# Altium schematic sheet battery-module-60mm-side.SchDoc
size A4; SheetNumber: 1; SheetTotal: 1
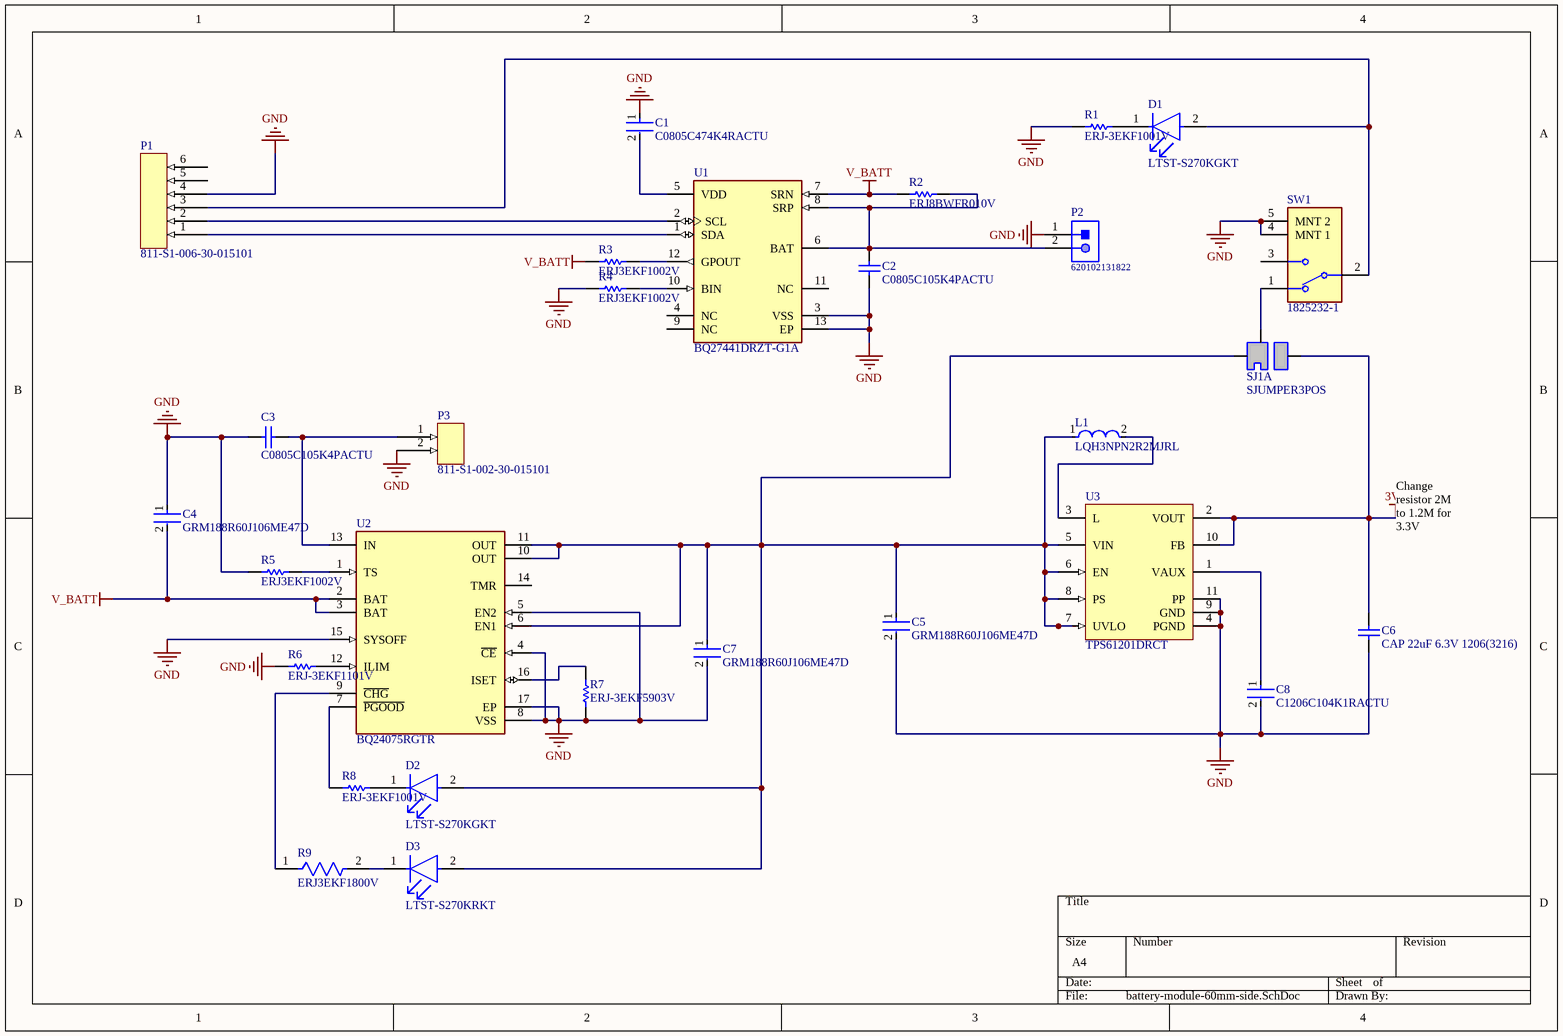
[diagram p0: battery-module-60mm-side.SchDoc]

## Parts
C1  C0805C474K4RACTU  [FP-C0805C-DN-MFG]
C2  C0805C105K4PACTU  [CAPC2013X145X50ML20T25]
C3  C0805C105K4PACTU  [CAPC2013X145X50ML20T25]
C4  GRM188R60J106ME47D  [FP-GRM188-0_1-e0_2_0_55-IPC_A]
C5  GRM188R60J106ME47D  [FP-GRM188-0_1-e0_2_0_55-IPC_A]
C6  CAP 22uF 6.3V 1206(3216)  [CAPC1206(3216)190_L]
C7  GRM188R60J106ME47D  [FP-GRM188-0_1-e0_2_0_55-IPC_A]
C8  C1206C104K1RACTU  [FP-C1206C-EB-MFG]
D1  LTST-S270KGKT  [FP-LTST-S270KGKT-MFG]
D2  LTST-S270KGKT  [FP-LTST-S270KGKT-MFG]
D3  LTST-S270KRKT  [FP-LTST-S270KRKT-MFG]
L1  LQH3NPN2R2MJRL  [FP-LQH3NPN_JR-MFG]
P1  811-S1-006-30-015101  [New footprint 1]
P2  620102131822  [620102131822]
P3  811-S1-002-30-015101  [811-S1-002-30-015101-Footprint-1]
R1  ERJ-3EKF1001V  [RESC1608X55X30ML15T15]
R2  ERJ8BWFR010V  [RESC3216X70X50NL05T20]
R3  ERJ3EKF1002V  [RESC1609X55X30ML15T15]
R4  ERJ3EKF1002V  [RESC1609X55X30ML15T15]
R5  ERJ3EKF1002V  [RESC1609X55X30ML15T15]
R6  ERJ-3EKF1101V  [RESC1608X55X30ML15T15]
R7  ERJ-3EKF5903V  [RESC1608X55X30ML15T15]
R8  ERJ-3EKF1001V  [RESC1608X55X30ML15T15]
R9  ERJ3EKF1800V  [FP-ERJ3EK-MFG]
SJ1  SJUMPER3POS  [SJUMPER3POS-Footprint-1]  (part A of 2)
SW1  1825232-1  [FP-1825232-1-MFG]
U1  BQ27441DRZT-G1A  [FP-DRZ0012A-MFG]
U2  BQ24075RGTR  [FP-RGT0016C-IPC_A]
U3  TPS61201DRCT  [DRC0010J_V]

## Nets
3V3: C6.2 SJ1.3 U3.2(VOUT) U3.10(FB)
GND: C1.1 C2.1 C3.2 C4.1 C5.2 C6.1 C7.2 C8.2 P1.4 P2.1 P3.2 R1.1 R4.1 R5.1 R6.1 R7.1 SW1.4(MNT_1) SW1.5(MNT_2) U1.3(VSS) U1.13(EP) U2.4(~{CE}) U2.5(EN2) U2.8(VSS) U2.15(SYSOFF) U2.17(EP) U3.4(PGND) U3.9(GND) U3.11(PP)
V_BATT: C4.2 R2.1 R3.1 U1.7(SRN) U2.2(BAT) U2.3(BAT)
NetC1_2: C1.2 U1.5(VDD)
NetC2_2: C2.2 P2.2 R2.2 U1.6(BAT) U1.8(SRP)
NetC3_1: C3.1 P3.1 U2.13(IN)
NetC5_1: C5.1 C7.1 D2.2(A) D3.2(A) L1.1 SJ1.1 U2.6(EN1) U2.10(OUT) U2.11(OUT) U3.5(VIN) U3.6(EN) U3.7(UVLO) U3.8(PS)
NetC8_1: C8.1 U3.1(VAUX)
NetD1_1: D1.1(C) R1.2
NetD1_2: D1.2(A) P1.3 SW1.2
NetD2_1: D2.1(C) R8.2
NetD3_1: D3.1(C) R9.2
NetL1_2: L1.2 U3.3(L)
NetP1_1: P1.1 U1.1(SDA)
NetP1_2: P1.2 U1.2(SCL)
NetR3_2: R3.2 U1.12(GPOUT)
NetR4_2: R4.2 U1.10(BIN)
NetR5_2: R5.2 U2.1(TS)
NetR6_2: R6.2 U2.12(ILIM)
NetR7_2: R7.2 U2.16(ISET)
NetR8_1: R8.1 U2.7(~{PGOOD})
NetR9_1: R9.1 U2.9(~{CHG})
NetSJ1_2: SJ1.2 SW1.1

Not connected (* = marked no-connect by the designer): P1 5 6; SW1 3; U1 4(NC) 9(NC) 11(NC); U2 14(TMR)

## Notes on the sheet
- Change resistor 2M to 1.2M for 3.3V

## Library data of the parts
C1 = CMP-2007-03296-2: CAP CER 0.47UF 16V 10% X7R 0805; Manufacturer: KEMET; Value: 0.47 μF; Temperature Coefficient: 30ppm/°C; Tolerance: 0.1; Material: Ceramic; Device Class L3: Ceramic Capacitors; RoHS: TRUE; ComponentLink2Description: Datasheet; Digikey Description: CAP CER 0.47UF 16V 10% X7R 0805; Temperature Characteristic: X7R; Device Class L1: Passive Components; Device Class L2: Capacitors; Octopart: https://octopart.com/c0805c474k4ractu-kemet-107561; Category: Cap; Ipc Land Pattern Name: CAPC200125X78; Package: C0805C-DN; Capacitance: 0.47 μF; ComponentLink2URL: https://content.kemet.com/datasheets/KEM_C1003_C0G_SMD.pdf; Automotive: No; Height: 0.88mm; Temperature: -55°C to +125°C; Manufacturer Part Number: C0805C474K4RACTU; Voltage Rating: 16 V; Temperature Range High: +125°C; Lead Free: Yes; Mouser Description: Multilayer Ceramic Capacitor, C Series, 0.47 - F, - 10%, X7r, 16 V, 0805 [2012 Metric] Rohs Compliant: Yes; Temperature Range Low: -55°C
C2 C3 = CMP-1036-04746-2: Manufacturer: Kemet; Part Number: C0805C105K4PACTU
C4 C5 C7 = CMP-2006-02792-2: Chip Multilayer Ceramic Capacitors for General Purpose, 0603, 10uF, X5R, 15%, 20%, 6.3V; Packaging: Tape and Reel; Voltage Rating (DC): 6.3V; Width: 0.031inch; Termination: SMD/SMT; Dielectric: X5R; Package Quantity: 4000; Voltage Rating: 6.3V; Capacitance: 10uF; Case/Package: 0603; Min Operating Temperature: -55°C; Voltage: 6.3V; Length: 1.6mm; Thickness: 0.035inch; Lead Free: Lead Free; Depth: 0.8mm; Case Code (Imperial): 0603; Max Operating Temperature: 85°C; Material: Ceramic; Height: 0.8mm; Tolerance: 20%; Mount: Surface Mount; REACH SVHC: No SVHC; Radiation Hardening: No; Case Code (Metric): 1608
C6 = CMP-1037-04986-1: CAP 22uF 6.3V ±20% 1206 (3216 Metric) Thickness 1.9mm SMD; Case-EIA: 1206; Tolerance: Â±20%; Case-Metric: 3216; Value: 22uF; Max Thickness: 1.9 mm; Rated Voltage: 6.3 V; Technology: SMT
C8 = CMP-03020-000153-1: CAP CER 0.1UF 100V X7R 1206; Manufacturer: KEMET; Value: 0.10 μF; Tolerance: 0.1; Material: Ceramic; Temperature Coefficient: 15%; Automotive Grade: Grade 0; Voltage Rating: 100 V; Automotive: Yes; Ipc Land Pattern Name: CAPC320160X78; Device Class L1: Passive Components; ComponentLink2Description: Datasheet; Temperature Range Low: -55°C; Category: Cap; Octopart: https://octopart.com/c1206c104k1ractu-kemet-89521; Height: 0.88mm; Lead Free: Yes; Digikey Description: CAP CER 0.1UF 100V X7R 1206; Mouser Description: CAP CER 0.1UF 100V X7R 1206; Device Class L3: Ceramic Capacitors; Device Class L2: Capacitors; ComponentLink2URL: https://content.kemet.com/datasheets/KEM_C1007_X8R_ULTRA_150C_SMD.pdf; Temperature Range High: +150°C; Temperature Characteristic: X7R; Manufacturer Part Number: C1206C104K1RACTU; RoHS: TRUE; Capacitance: 0.10 μF; Package: C1206C-EB; Temperature: -55°C to +150°C
D1 D2 = CMP-2000-06629-2: LED GREEN CLEAR CHIP SMD R/A; Luminous Intensity: 71mcd; Test Current: 20mA; Dominant Wavelength: 571nm; Lens Style: Diffused; Forward Voltage: 2V; Reverse Voltage: 5V; Wavelength: 574nm; Power Rating: 75mW; Viewing Angle: 130°; Number of Elements: 1; Forward Current: 30mA; Lens Color: Colorless; Package Quantity: 1; Lead Free: Lead Free; Case Code (Imperial): 0603; Lens Transparency: Clear; Width: 1.15mm; Case Code (Metric): 1608; Packaging: Tape and Reel; Depth: 0.6mm; Radiation Hardening: No; Color: Green; Max Operating Temperature: 85°C; Case/Package: 0603; Min Operating Temperature: -55°C; Number of LEDs: 1; Power Dissipation: 75mW; Illumination Color: Green; Number of Pins: 2; Height: 0.6mm; Mount: Surface Mount; Length: 1.6mm
D3 = CMP-2000-06630-2: LED RED CLEAR CHIP SMD R/A; Test Current: 20mA; Number of LEDs: 1; Power Rating: 75mW; Lens Style: Diffused; Luminous Intensity: 54mcd; Wavelength: 639nm; Dominant Wavelength: 631nm; Lens Color: Colorless; Forward Voltage: 2V; Viewing Angle: 130°; Forward Current: 30mA; Reverse Voltage: 5V; Illumination Color: Red; Case Code (Imperial): 0603; Color: Red; Packaging: Tape and Reel; Number of Pins: 2; Length: 1.6mm; Lens Transparency: Clear; Width: 1.15mm; Power Dissipation: 75mW; Lead Free: Lead Free; Max Power Dissipation: 75mW; Case/Package: 0603; Max Operating Temperature: 85°C; Mount: Surface Mount; Depth: 0.6mm; Number of Elements: 1; Radiation Hardening: No; Case Code (Metric): 1608; Package Quantity: 1; Height: 0.6mm; Min Operating Temperature: -55°C
L1 = CMP-06042-014664-1: Wire Wound Ferrite Inductor for Power Lines 2.2μH ±20% 0.0816Ω 2200mA 1212; Current Rating: 980mA; Shielding: Shielded; Test Frequency: 1MHz; Saturation Current: 1.8A; Inductance: 2.2uH; Self Resonant Frequency: 45MHz; DC Resistance (DCR): 81.6mR; Case Code (Imperial): 1212; Mount: Surface Mount; Height - Seated (Max): 0.047inch; Min Operating Temperature: -40°C; Tolerance: 20%; Length: 0.118inch; Max Operating Temperature: 105°C; Case Code (Metric): 3030; Resistor Type: Wirewound; Core Material: Ferrite; Width: 0.118inch; Packaging: Tape and Reel; Case/Package: 1212
P1 = CMP-002-00071-2: Conn Spring Piston 6POS SMD
P2 = CMP-1502-00669-1: Male Shrouded Header WR-WTB, SMT, Right Angled, pitch 2 mm, 1 x 2 position; Manufacturer: Wurth Elektronik; Position: 1x2; Working Voltage: 100VAC; Contact Resistance: 20mOhm; Pitch: 2mm; Packaging: TapeandReel; Part Number: 620102131822; Publisher: WurthElektronik; Mounting Technology: SMT; Manufacturer URL: http://www.we-online.de; Datasheet URL: https://katalog.we-online.de/em/datasheet/6201xx131822.pdf; Gender: Male; Operating Temperature: -25to85degC; Package Reference: 620102131822; Orientation: RightAngled
P3 = CMP-002-00073-2: Conn Spring Loaded Connector HDR 2 POS 2.54mm Solder ST SMD T/R
R1 R8 = CMP-2000-00180-1: Manufacturer: Panasonic; Part Number: ERJ-3EKF1001V
R2 = CMP-2003-00764-1: Manufacturer: Panasonic; Part Number: ERJ8BWFR010V
R3-R5 = CMP-1012-00623-3: Chip Resistor, 10 KOhm, +/- 1%, 0.1 W, -55 to 155 degC, 0603 (1608 Metric), RoHS, Tape and Reel; Manufacturer: Panasonic; Voltage Rating: 75V; Case\/Package: 0603; Power Rating: 100mW; Resistance: 10KOhm; Temperature Coefficient: 100ppm\/degreesC; Number of Pins: 2; Package Reference: 603; Depth: 0.8mm; Mount: SurfaceMount; Package Description: 2-Pin Surface Mount Device, Body 1.6 x 0.85 mm; Datasheet Version: 02/2017; Length: 1.6mm; Lead Free: LeadFree; Height: 0.45mm; Number of Terminations: 2; Max Power Dissipation: 100mW; Min Operating Temperature: -55degC; Datasheet URL: https://industrial.panasonic.com/cdbs/www-data/pdf/RDA0000/AOA0000C304.pdf; Termination: SMD/SMT; Case Code (Metric): 1608; Case Code (Imperial): 0603; Tolerance: 1%; Max Operating Temperature: 155degC; RoHSCompliant: true; Voltage Rating (DC): 75V; Radiation Hardening: No; Packaging: TapeandReel; Composition: ThickFilm; Mounting Technology: SurfaceMount; Manufacturer URL: http://www.panasonic.com/; Width: 0.031inch; REACH SVHC: NoSVHC; Contact Plating: Tin; Military Standard: Not; Package Quantity: 1
R6 = CMP-2000-00198-1: Manufacturer: Panasonic; Part Number: ERJ-3EKF1101V
R7 = CMP-2000-00582-1: Manufacturer: Panasonic; Part Number: ERJ-3EKF5903V
R9 = CMP-2000-00293-2: RES SMD 180 OHM 1% 1/10W 0603; Manufacturer: Panasonic; Value: 180Ω; Power Rating: 0.1W; Temperature Coefficient: 100ppm/°C; Voltage Rating: 75V; Automotive Grade: Grade 0; Digikey Description: RES SMD 180 OHM 1% 1/10W 0603; Series: ERJ; Octopart: https://octopart.com/erj-3ekf1800v-panasonic-55421532; Footprint Url: https://industrial.panasonic.com/cdbs/www-data/pdf/RDA0000/DMA0000COL17.pdf; Temperature: -55°C to +155°C; ComponentLink2Description: Datasheet; Device Class L3: Chip SMD Resistors; Temperature Range High: +155°C; RoHS: TRUE; Category: Res; Device Class L2: Resistors; Package: ERJ3EK; Mouser Description: Thick Film Resistors 0603 180ohms 1% AEC-Q200; Manufacturer Part Number: ERJ3EKF1800V; Resistance: 180Ω; Temperature Range Low: -55°C; Device Class L1: Passive Components; Automotive: Yes; ComponentLink2URL: https://industrial.panasonic.com/cdbs/www-data/pdf/RDA0000/AOA0000C304.pdf; Tolerance: 1%; Lead Free: Yes; Composition: Thick Film; Height: 0.55mm
SJ1 = CMP-001-0001-1: 3 pins solder jumper
SW1 = CMP-03405-000001-1: SWITCH SLIDE SPDT 200MA 30V; Manufacturer: TE Connectivity; Contact Current Rating: 0.2A; Contact Resistance: 20mΩ; Electromechanical Life: 10000Cycles; Operating Force: 200gf; Throw Configuration: SPDT; Manufacturer Part Number: 1825232-1; Temperature Range High: +70°C; Height: 3.7mm; ComponentLink2URL: https://www.te.com/commerce/DocumentDelivery/DDEController?Action=showdoc&DocId=Customer+Drawing%7F1825232%7FB2%7Fpdf%7FEnglish%7FENG_CD_1825232_B2.pdf%7F1825232-1; Mount: Through Hole; Mouser Description: Slide Switches SLIDE SWITCH SPDT Right Angle; Package: 1825232-1; Temperature: -20°C to +70°C; Automotive: No; ComponentLink2Description: Datasheet; Lead Free: Yes; Octopart: https://octopart.com/1825232-1-te+connectivity-45209882; Device Class L1: Electromechanical; Digikey Description: SWITCH SLIDE SPDT 200MA 30V; Device Class L3: Slide Switches; Device Class L2: Switches; Voltage Rating Dc: 30V; Temperature Range Low: -20°C; Category: Switch; RoHS: TRUE
U1 = CMP-04911-000005-1: IC BATT FUEL GAUGE LICOO2 12SON; Manufacturer: Texas Instruments; Nominal Supply Current: 93uA; Standoff Height: 0mm; Output Voltage: 1.8V; Number Of Outputs: 1; Min Supply Voltage: 2.45V; Max Supply Voltage: 4.5V; ComponentLink2URL: http://www.ti.com/lit/ds/symlink/bq27441-g1.pdf; Device Class L1: Integrated Circuits (ICs); Package: DRZ0012A; Number Of Cells: 1; Mouser Description: Battery Management System-Side Impdance Trck Bttry Fuel Gge; ComponentLink2Description: Datasheet; Device Class L2: Power Management ICs; Temperature Range High: +85°C; Category: IC; Automotive: No; Octopart: https://octopart.com/bq27441drzt-g1a-texas+instruments-30555831; Temperature Range Low: -40°C; Device Class L3: Battery Management; RoHS: TRUE; Height: 1mm; Digikey Description: IC BATT FUEL GAUGE LICOO2 12SON; Temperature: -40°C to +85°C; Ambient Temperature Range High: +85°C; Ambient Temperature Range Low: -40°C; Manufacturer Part Number: BQ27441DRZT-G1A; Lead Free: Yes
U2 = CMP-0321-00238-3: IC LI-ION CHARGE MGMT 16-QFN; Max Supply Voltage: 6.4V; Number of Cells: 1; Min Supply Voltage: 4.35V; Battery Chemistry: LITHIUM-ION; Max Charge Current: 1.5A; Output Voltage: 4.2V; Interface: USB; Min Input Voltage: 4.3V; Fault Protection: Over Voltage; Weight: 0.000808oz; Package Quantity: 3000; Min Operating Temperature: -40°C; Case/Package: VQFN; Lead Free: Lead Free; Number of Pins: 16; RoHS Compliant: Yes; Series: -; Packaging: Tape and Reel; Output Current: 1.5A; Contact Plating: Gold; Battery Pack Voltage: 4.2V; Max Operating Temperature: 125°C; Radiation Hardening: No
U3 = CMP-0343-00033-2: Boost Voltage Converter with 0.3 to 5.5 V Input and 3.3 V Output, -40 to 85 degC, 10-Pin SON (DRC), Green (RoHS & no Sb/Br); Manufacturer: Texas Instruments; Switching Frequency(Max)(kHz): 1250; Vin(Min)(V): 0.3; Preset Vout(V): 3.3; Vin(Max)(V): 5.5; Regulated Outputs(#): 1; Synchronous Rectification: TRUE; SubFamily: Step-Up Regulator; ComponentLink2Description: Package Specification; PackageVersion: revL, Sep-2011; DatasheetVersion: SLVS577B; PackageReference: DRC0010J; PackageDescription: 10-Pin Plastic Small Outline No-Lead, 3 x 3 x 1 mm Body, 0.5 mm Pitch, Exposed Pad; Vout(Min)(V): 3.3; ComponentLink1URL: http://www.ti.com/general/docs/lit/getliterature.tsp?genericPartNumber=TPS61201&fileType=pdf; ComponentLink1Description: Datasheet; Topology: Boost; Mounting Technology: Surface Mount; ComponentLink2URL: http://www.ti.com/litv/pdf/mpds117k; PartNumber: TPS61201DRCT; Eco-Plan: Green (RoHS & no Sb/Br); Vout(Max)(V): 3.3